# Altium schematic sheet DC_DC_5V.SchDoc
size Tabloid
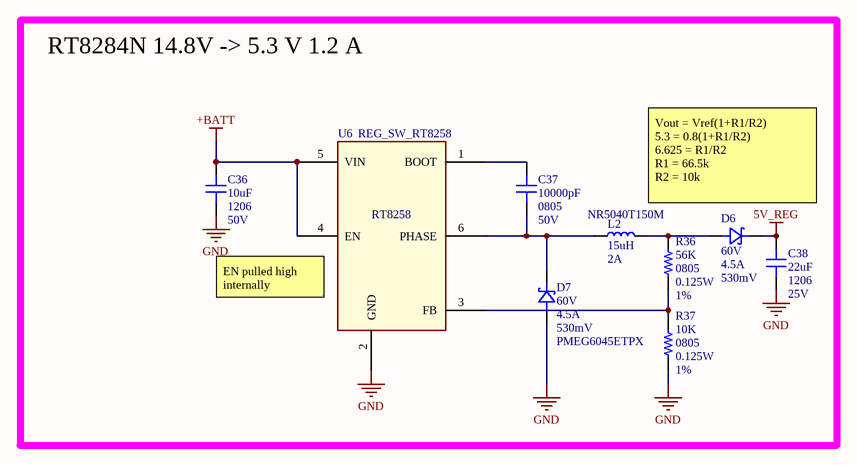
[diagram p0: DC_DC_5V.SchDoc]

## Parts
C36  value 10uF  Package: 1206  Voltage: 50V  [CAP_1206]  (hidden comment: CAP_GRT31CR61H106ME01L‎)
C37  value 10000pF  Package: 0805  Voltage: 50V  [CAP_0805]  (hidden comment: CAP_‎‎‎‎CL21B103KBANNNC)
C38  value 22uF  Package: 1206  Voltage: 25V  [CAP_1206]  (hidden comment: CAP_‎‎CL31A226KAHNNNE‎)
D6  Voltage: 60V  Current: 4.5A  Vf: 530mV  [DO-214AC_SOD128]  (hidden comment: DIODE_SCH_PMEG6045ETPX)
D7  Voltage: 60V  Current: 4.5A  Vf: 530mV  Part number: PMEG6045ETPX  [DO-214AC_SOD128]  (hidden comment: DIODE_SCH_PMEG6045ETPX)
L2  value 15uH  Current: 2A  [NR5040T150M]  (hidden comment: IND_NR5040T150M)
R36  value 56K  Package: 0805  Power: 0.125W  Tolerance: 1%  [RES_0805]  (hidden comment: RES_‎‎‎‎RC0805FR-0756KL)
R37  value 10K  Package: 0805  Power: 0.125W  Tolerance: 1%  [RES_0805]  (hidden comment: RES_‎‎‎‎‎RMCF0805FT10K0‎)
U6  REG_SW_RT8258  [SOT23-6]

## Blocks framed on the sheet
RT8284N 14.8V -> 5.3 V 1.2 A: C36-C38 D6 D7 L2 R36 R37 U6

## Nets
5V_REG: C38.1 D6.2
+BATT: C36.1 U6.4(EN) U6.5(VIN)
GND: C36.2 C38.2 D7.1 R37.2 U6.2(GND)
NetC37_1: C37.1 U6.1(BOOT)
NetC37_2: C37.2 D7.2 L2.1 U6.6(PHASE)
NetD6_1: D6.1 L2.2 R36.1
NetR36_2: R36.2 R37.1 U6.3(FB)

## Notes on the sheet
- Vout = Vref(1+R1/R2)
  5.3 = 0.8(1+R1/R2)
  6.625 = R1/R2
  R1 = 66.5k
  R2 = 10k
- (near U6) EN pulled high internally
- Sheet Name
- Project Title
- Global Project
- Size
- Group
- Revision
- Date
- Sheet
- of
- Filename
- Designers

## Library data of the parts
C36 = CAP_GRT31CR61H106ME01L‎: CAP CER 10uF 50V 1206; Part number: GRT31CR61H106ME01L‎
C37 = CAP_‎‎‎‎CL21B103KBANNNC: CAP CER 10000pF 50V 0805; Part number: ‎CL21B103KBANNNC
C38 = CAP_‎‎CL31A226KAHNNNE‎: CAP CER 22uF 25V 1206; Part number: CL31A226KAHNNNE‎
D6 D7 = DIODE_SCH_PMEG6045ETPX: Diode Schottky 60V 4.5A Surface Mount CFP5; Package: SOD-128
  D6: Part number: PMEG6045ETPX
L2 = IND_NR5040T150M: 15µH Shielded Wirewound Inductor 1.8A 104mOhm Max Nonstandard; Package: Nonstandard; Part number: NR5040T150M
R36 = RES_‎‎‎‎RC0805FR-0756KL: RES 56K 1% 1/8W 0805; Part number: ‎RC0805FR-0756KL
R37 = RES_‎‎‎‎‎RMCF0805FT10K0‎: RES 10K 1% 1/8W 0805; Part number: ‎RMCF0805FT10K0‎
U6 = REG_SW_RT8258: REG 1.2A, 24V, 700kHz Step-Down Converter; Part number: RT8258